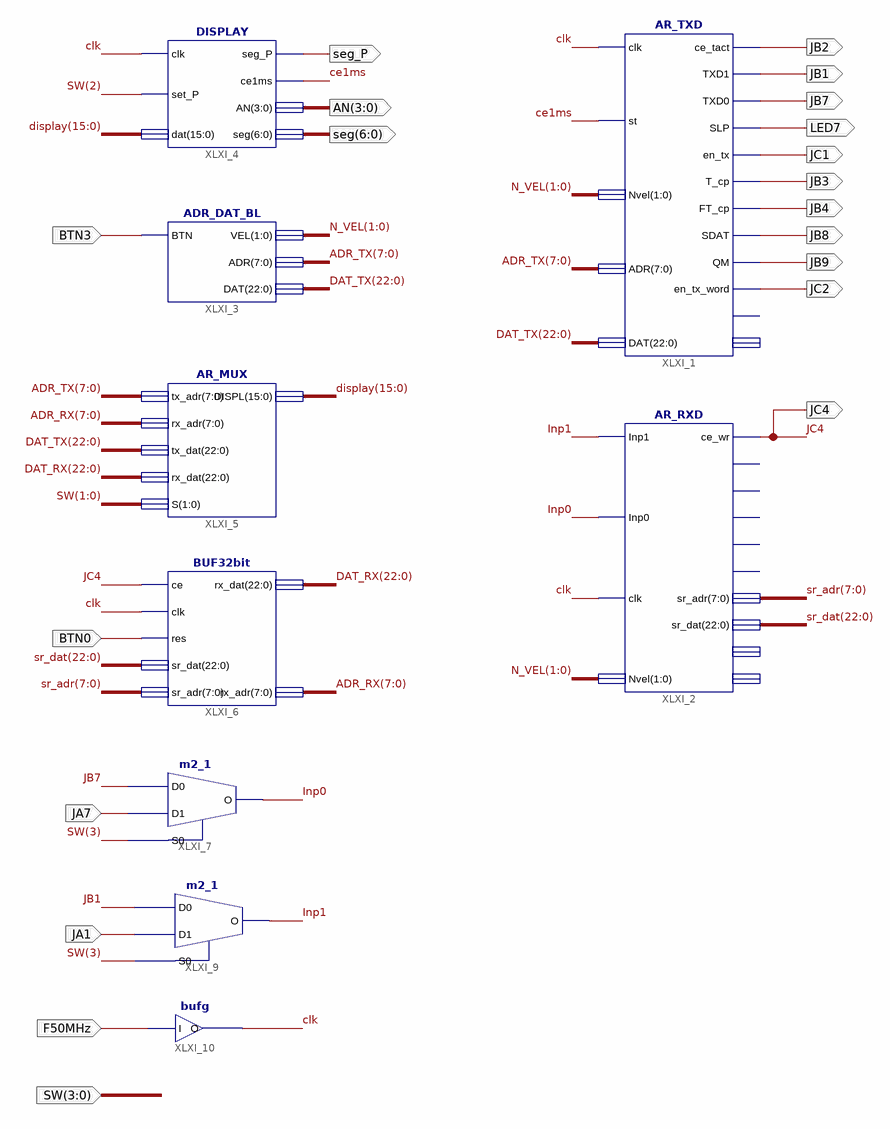
[diagram p0: schematic sheet 1]
// Xilinx ISE schematic Sch_Lab405ND.sch (spartan3e) as structural Verilog: 9 symbols, 20 ports
module Sch_Lab405ND (
  input  BTN3,
  input  BTN0,
  input  JA7,
  input  JA1,
  input  F50MHz,
  input  [3:0] SW,
  output JB7,
  output JB1,
  output LED7,
  output JC1,
  output JB9,
  output JB8,
  output JC2,
  output JB3,
  output JB4,
  output JB2,
  output seg_P,
  output [3:0] AN,
  output [6:0] seg,
  output JC4
);

  wire ce1ms, clk, Inp0, Inp1;
  wire [1:0] N_VEL;
  wire [7:0] ADR_RX, ADR_TX, sr_adr;
  wire [15:0] display;
  wire [22:0] DAT_RX, DAT_TX, sr_dat;

  AR_TXD XLXI_1 (
    .clk(clk), .st(ce1ms), .Nvel(N_VEL), .ADR(ADR_TX), .DAT(DAT_TX), .ce_tact(JB2), .TXD1(JB1), .TXD0(JB7),
    .SLP(LED7), .en_tx(JC1), .T_cp(JB3), .FT_cp(JB4), .SDAT(JB8), .QM(JB9), .en_tx_word(JC2));  // open: start, cb_bit
  AR_RXD XLXI_2 (
    .Inp1(Inp1), .Inp0(Inp0), .clk(clk), .Nvel(N_VEL), .ce_wr(JC4), .sr_adr(sr_adr), .sr_dat(sr_dat));  // open: res, FT_cp, ce_tact, ok_rx, T_cp, cb_bit, cb_res
  ADR_DAT_BL XLXI_3 (.BTN(BTN3), .VEL(N_VEL), .ADR(ADR_TX), .DAT(DAT_TX));
  DISPLAY XLXI_4 (.clk(clk), .set_P(SW[2]), .dat(display), .seg_P(seg_P), .ce1ms(ce1ms), .AN(AN), .seg(seg));
  AR_MUX XLXI_5 (.tx_adr(ADR_TX), .rx_adr(ADR_RX), .tx_dat(DAT_TX), .rx_dat(DAT_RX), .S(SW[1:0]), .DISPL(display));
  BUF32bit XLXI_6 (.ce(JC4), .clk(clk), .res(BTN0), .sr_dat(sr_dat), .sr_adr(sr_adr), .rx_dat(DAT_RX), .rx_adr(ADR_RX));
  m2_1 XLXI_7 (.D0(JB7), .D1(JA7), .S0(SW[3]), .O(Inp0));
  m2_1 XLXI_9 (.D0(JB1), .D1(JA1), .S0(SW[3]), .O(Inp1));
  bufg XLXI_10 (.I(F50MHz), .O(clk));
endmodule
